# Altium schematic sheet 0154_BATTERY PATH.SchDoc
size 848 x 558 mm
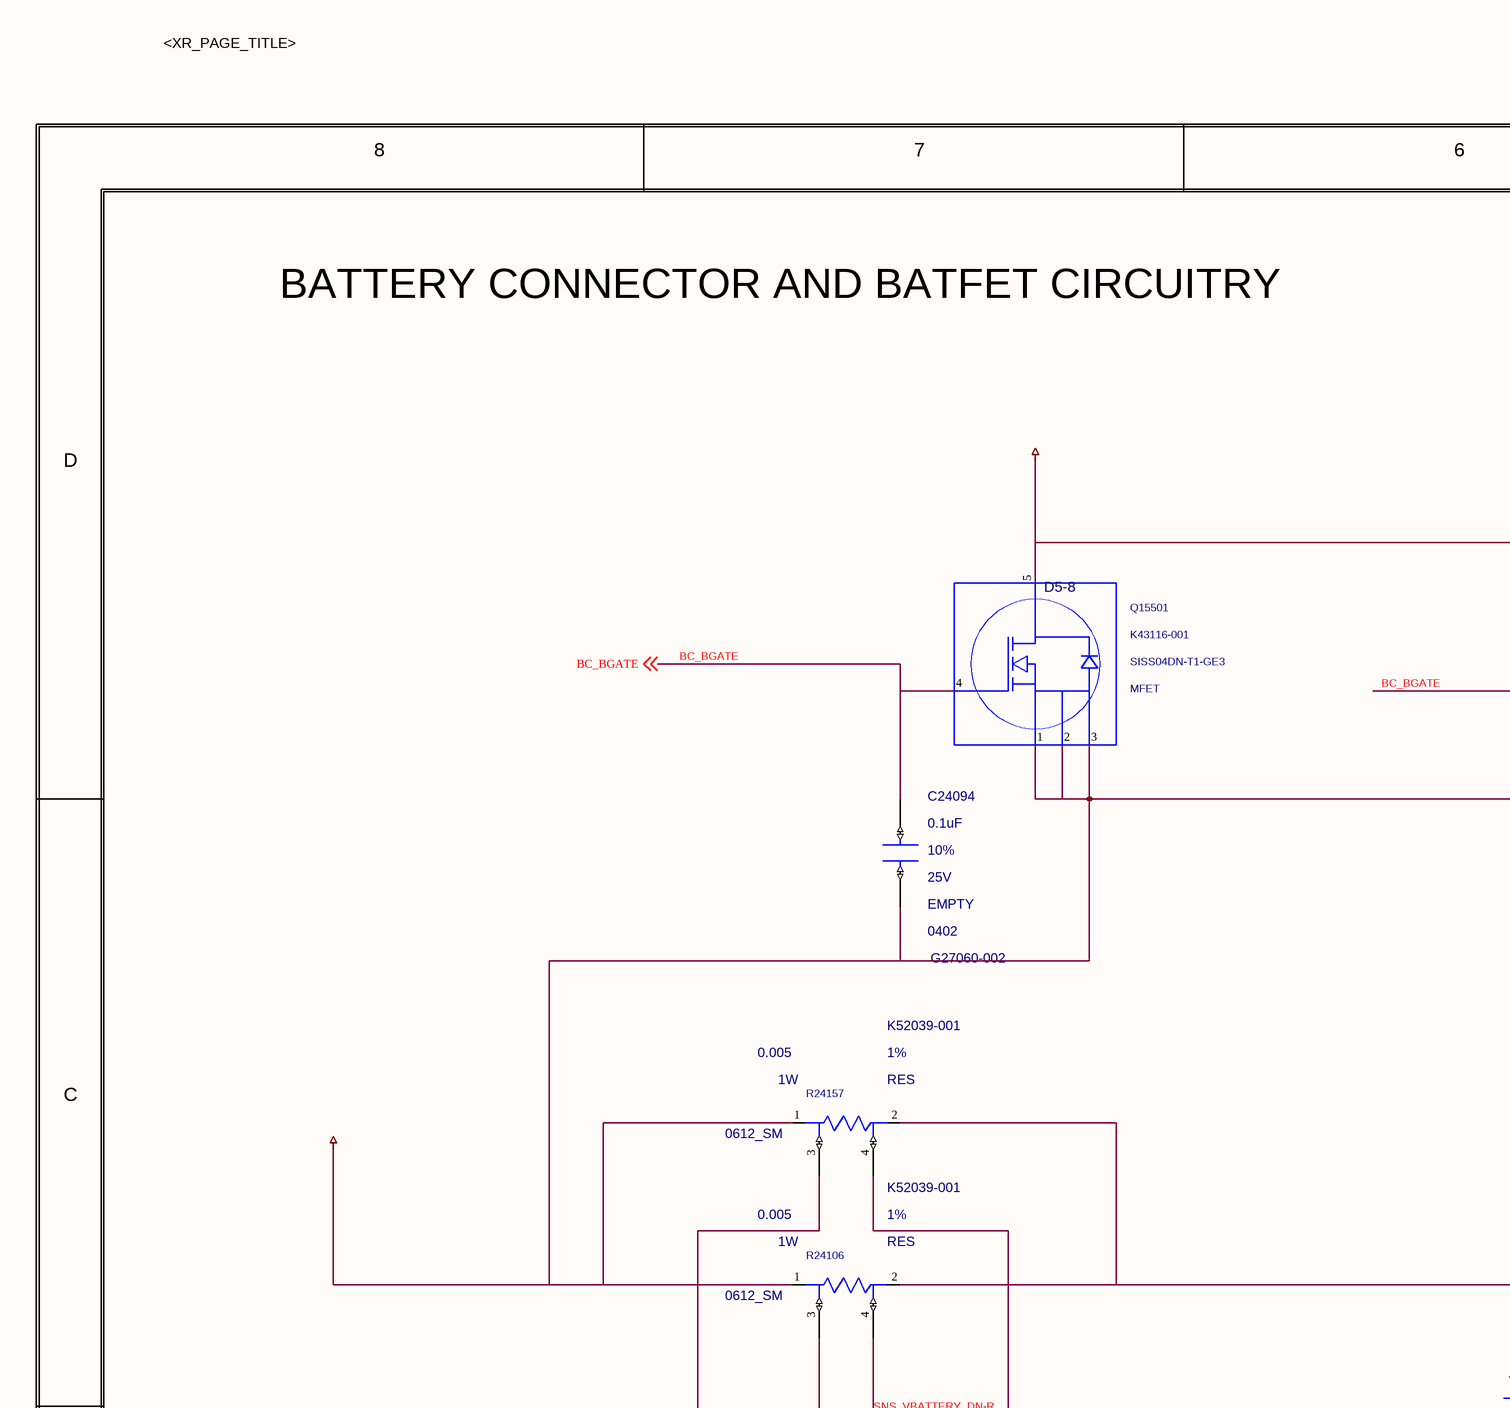
[diagram p0: 0154_BATTERY PATH.SchDoc, top left]
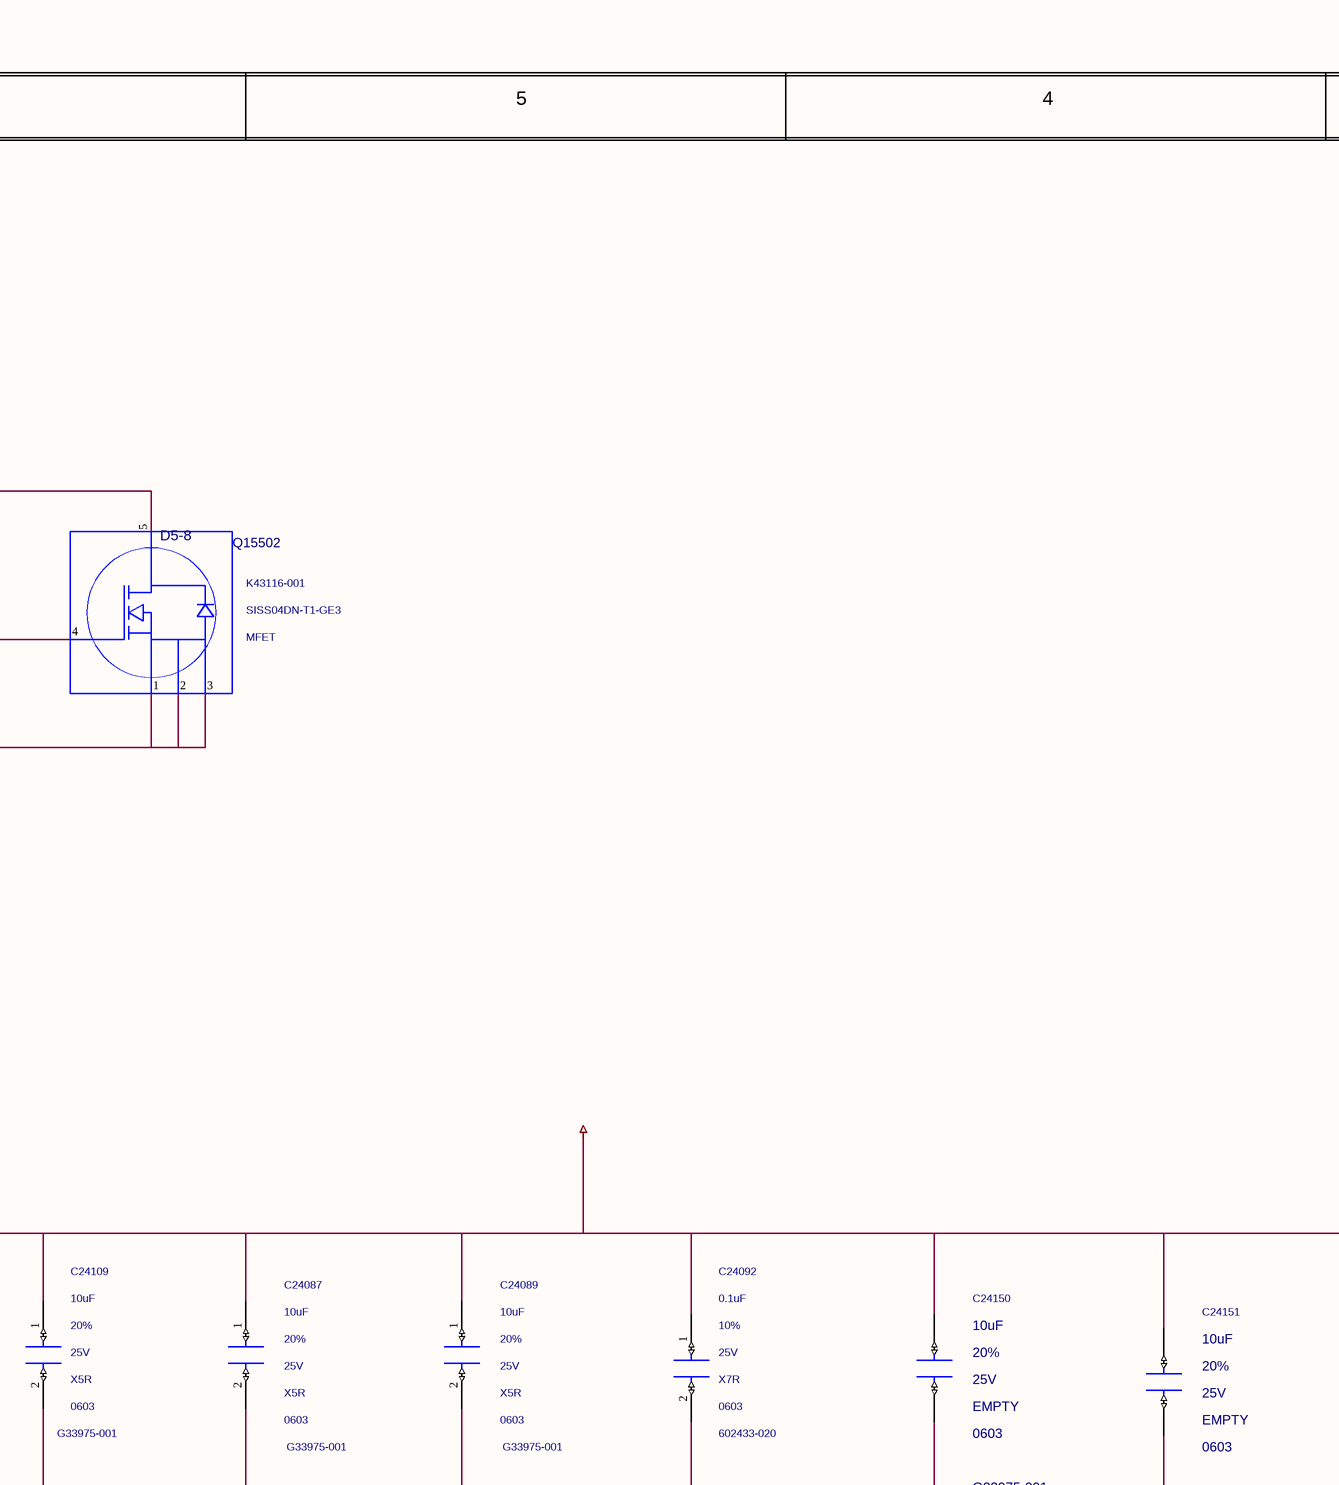
[diagram p1: 0154_BATTERY PATH.SchDoc, top middle]
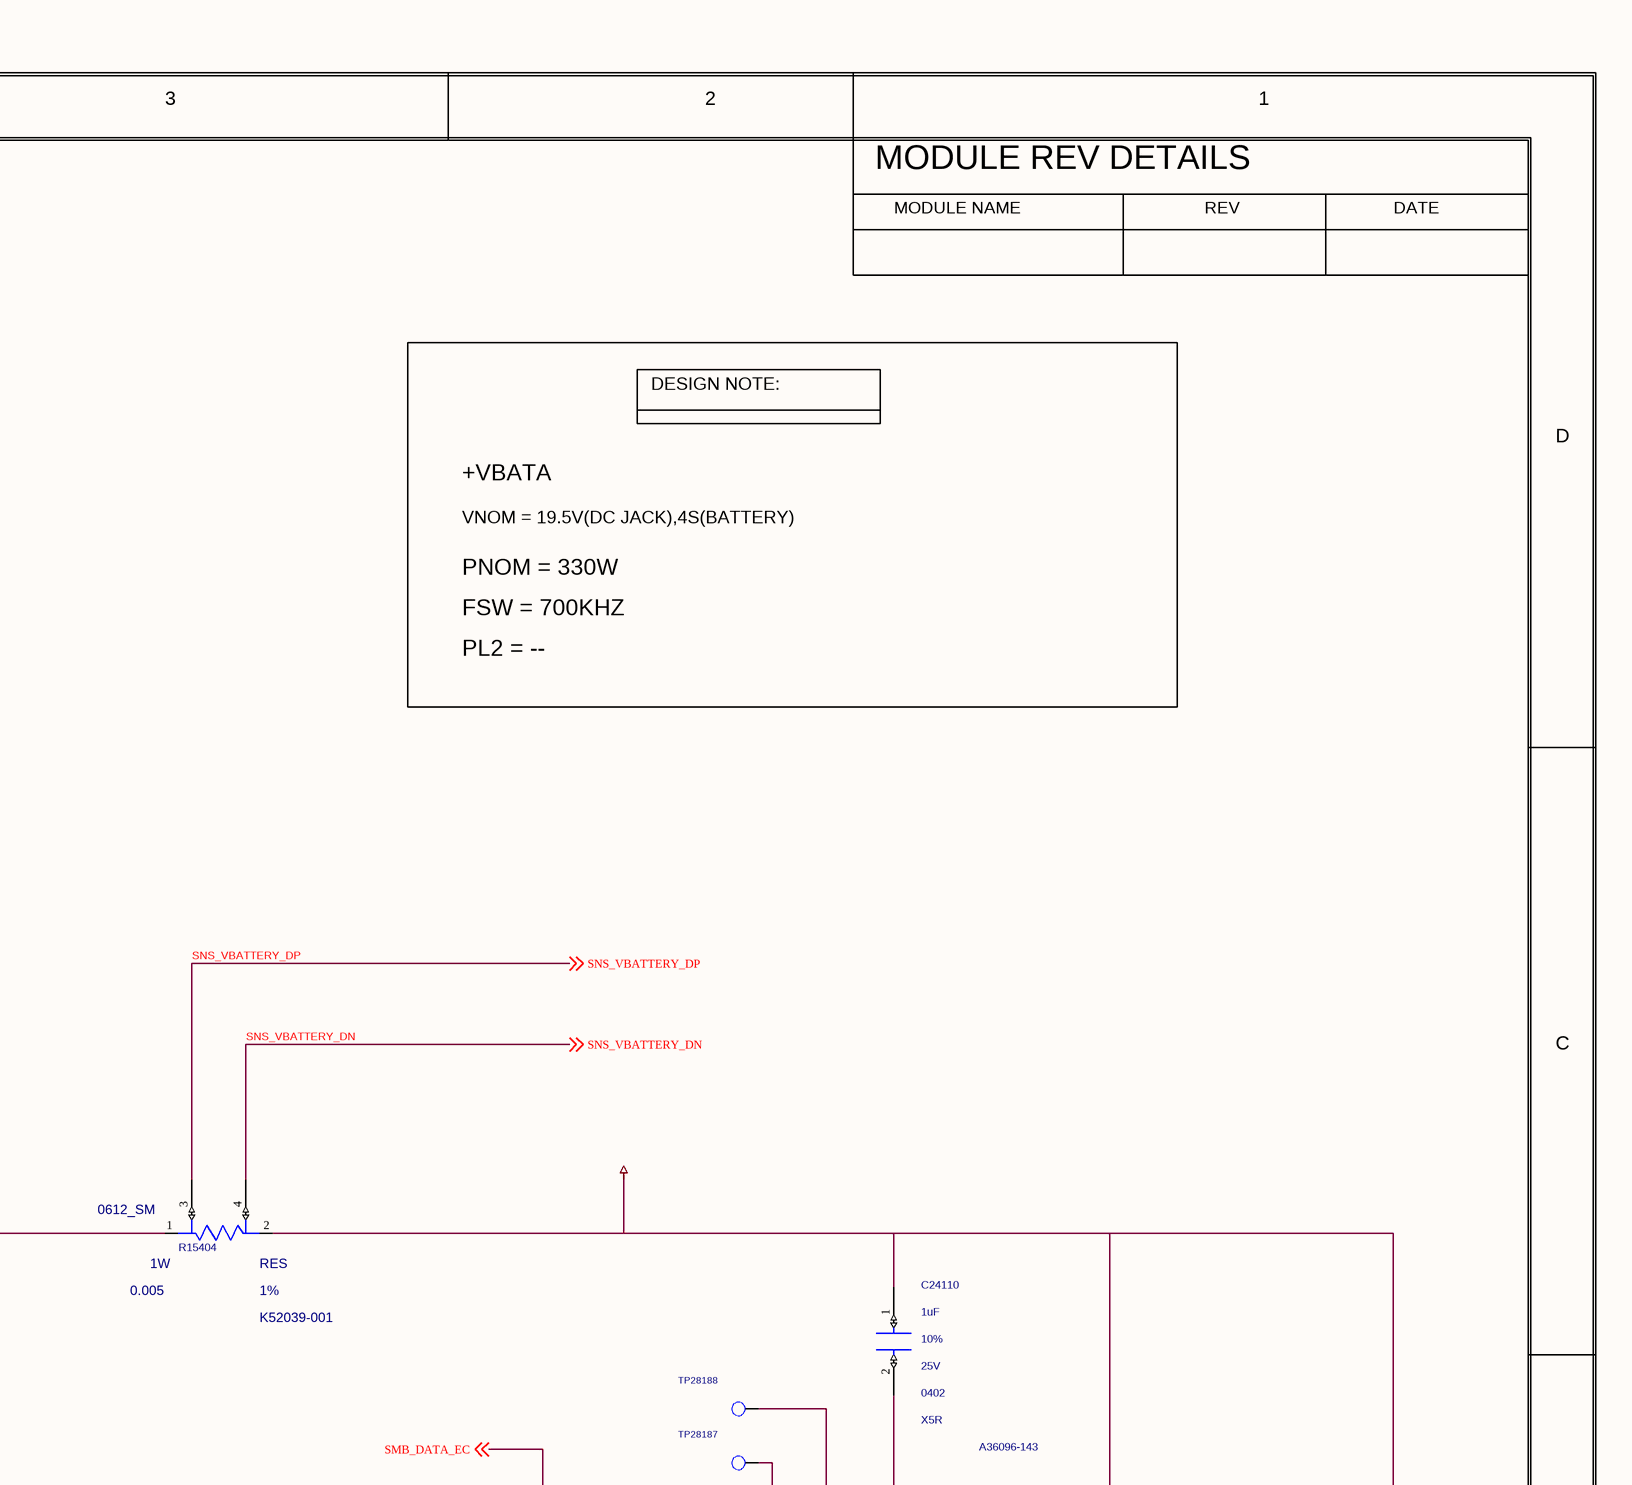
[diagram p2: 0154_BATTERY PATH.SchDoc, top right]
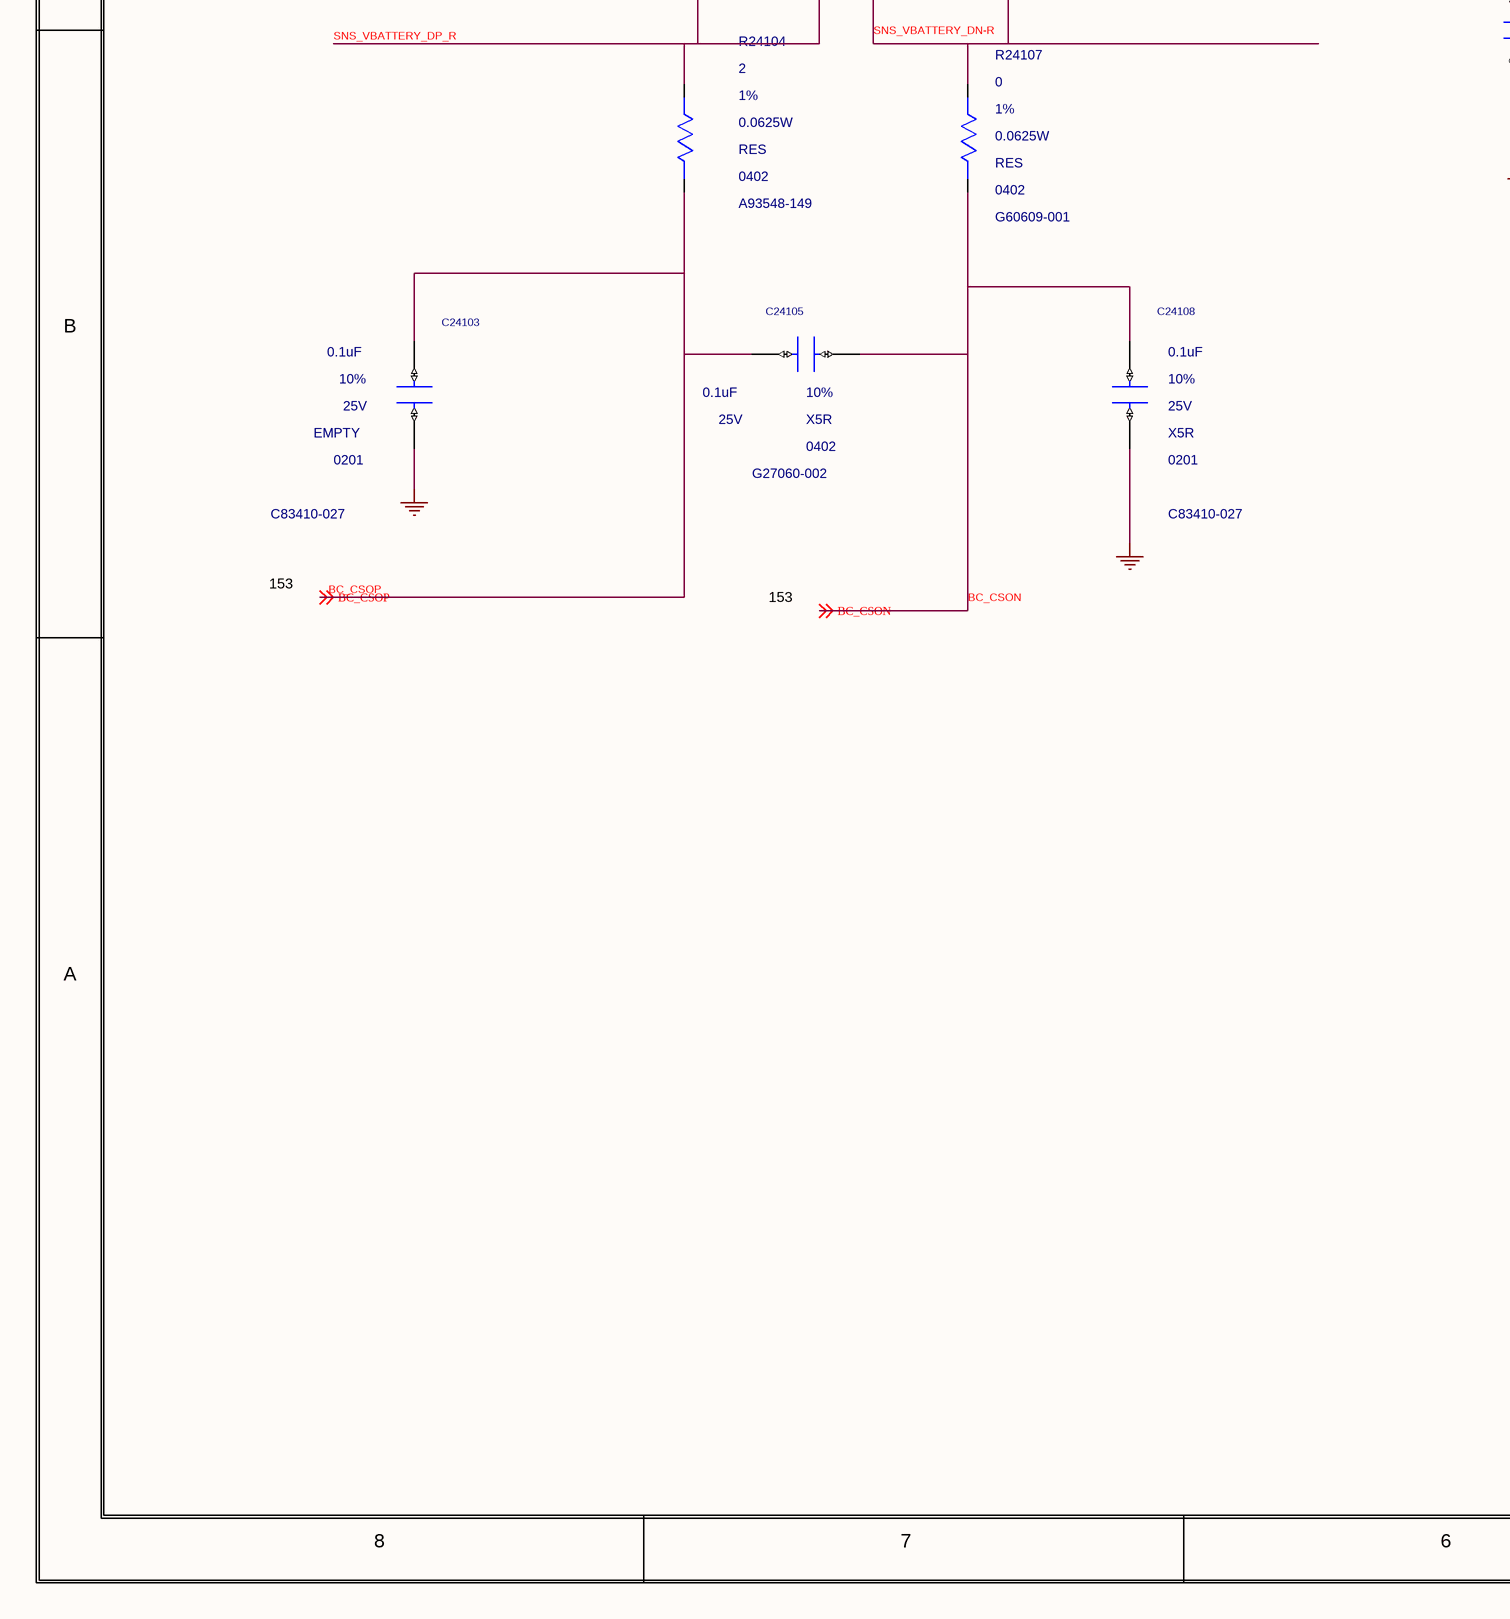
[diagram p3: 0154_BATTERY PATH.SchDoc, bottom left]
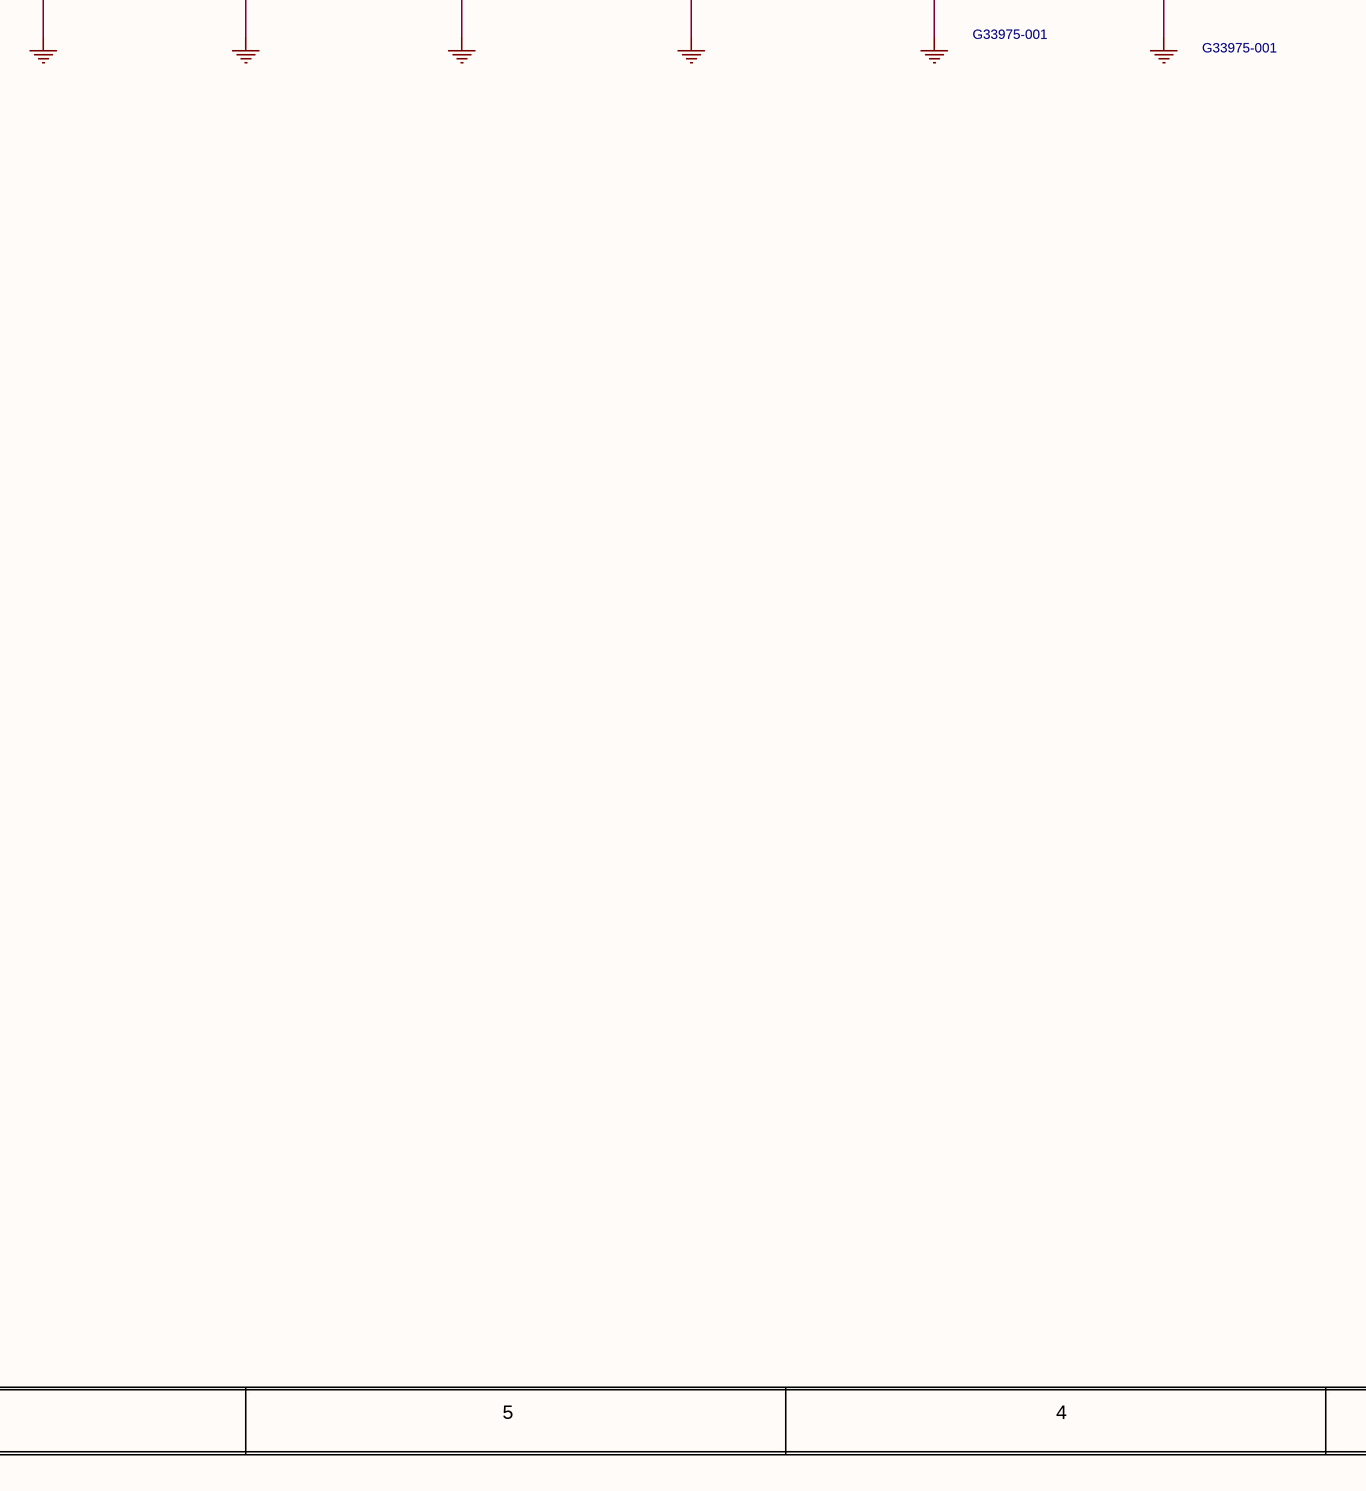
[diagram p4: 0154_BATTERY PATH.SchDoc, bottom middle]
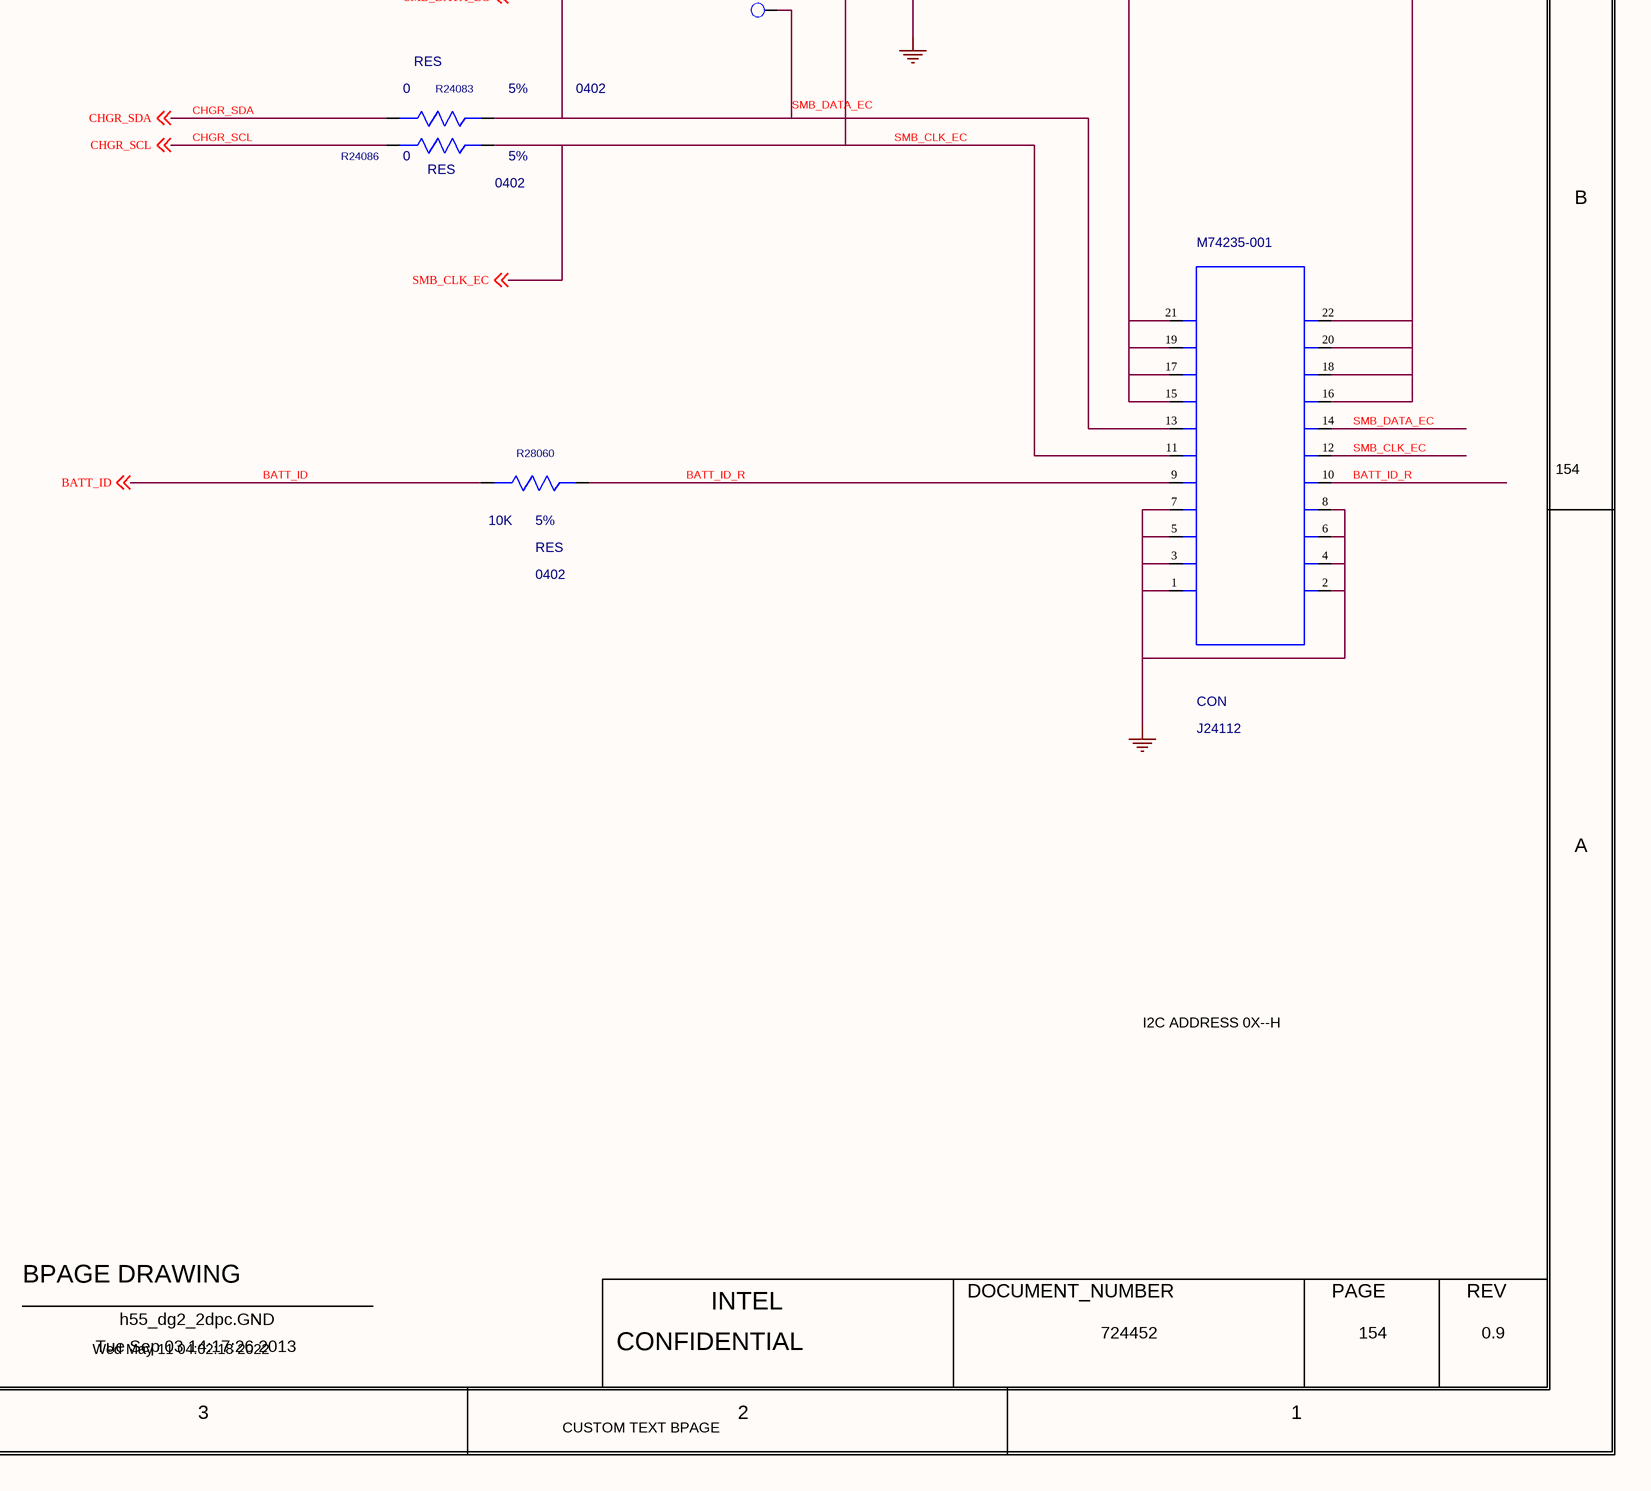
[diagram p5: 0154_BATTERY PATH.SchDoc, bottom right]

## Parts
C24087  10uF  MATERIAL: X5R  PACK_TYPE: 0603  PART_NUMBER: G33975-001  TOLERANCE: 20%  VOLTAGE: 25V  [SMC0603IA]
C24089  10uF  MATERIAL: X5R  PACK_TYPE: 0603  PART_NUMBER: G33975-001  TOLERANCE: 20%  VOLTAGE: 25V  [SMC0603IA]
C24092  0.1uF  MATERIAL: X7R  PACK_TYPE: 0603  PART_NUMBER: 602433-020  TOLERANCE: 10%  VOLTAGE: 25V  [SMC0603IA]
C24094  0.1uF  MATERIAL: EMPTY  PACK_TYPE: 0402  PART_NUMBER: G27060-002  TOLERANCE: 10%  VOLTAGE: 25V  [TK0_SM0402_1050X550_MB]
C24103  0.1uF  MATERIAL: EMPTY  PACK_TYPE: 0201  PART_NUMBER: C83410-027  TOLERANCE: 10%  VOLTAGE: 25V  [CTK2_SM0201_650X350_MA]
C24105  0.1uF  MATERIAL: X5R  PACK_TYPE: 0402  PART_NUMBER: G27060-002  TOLERANCE: 10%  VOLTAGE: 25V  [CTK2_SM0402_1050X550_MA]
C24108  0.1uF  MATERIAL: X5R  PACK_TYPE: 0201  PART_NUMBER: C83410-027  TOLERANCE: 10%  VOLTAGE: 25V  [CTK2_SM0201_650X350_MA]
C24109  10uF  MATERIAL: X5R  PACK_TYPE: 0603  PART_NUMBER: G33975-001  TOLERANCE: 20%  VOLTAGE: 25V  [SMC0603IA]
C24110  1uF  MATERIAL: X5R  PACK_TYPE: 0402  PART_NUMBER: A36096-143  TOLERANCE: 10%  VOLTAGE: 25V  [SMC0402MA]
C24150  10uF  MATERIAL: EMPTY  PACK_TYPE: 0603  PART_NUMBER: G33975-001  TOLERANCE: 20%  VOLTAGE: 25V  [CTK0_SM0603_1800X1000_MA]
C24151  10uF  MATERIAL: EMPTY  PACK_TYPE: 0603  PART_NUMBER: G33975-001  TOLERANCE: 20%  VOLTAGE: 25V  [CTK0_SM0603_1800X1000_MA]
J24112  MATERIAL: CON  PART_NUMBER: M74235-001  [CTK0_B2B_SPR_2X11_1500_MA_VR]  (hidden comment: C_B2B_2X11)
Q15501  SISS04DN-T1-GE3  MATERIAL: MFET  PART_NUMBER: K43116-001  [CTK0_LCC8_S3300_650_MA_VR]
Q15502  SISS04DN-T1-GE3  MATERIAL: MFET  PART_NUMBER: K43116-001  [CTK0_LCC8_S3300_650_MA_VR]
R15404  0.005  MATERIAL: RES  PACK_TYPE: 0612_SM  PART_NUMBER: K52039-001  TOLERANCE: 1%  WATTAGE: 1W  [CTK0_SMR4_0612_1800X3450_MB_VR]
R24083  0  MATERIAL: RES  PACK_TYPE: 0402  TOLERANCE: 5%  [CTK2_SM0402_1100X550_MA]
R24086  0  MATERIAL: RES  PACK_TYPE: 0402  TOLERANCE: 5%  [CTK2_SM0402_1100X550_MA]
R24104  2  MATERIAL: RES  PACK_TYPE: 0402  PART_NUMBER: A93548-149  TOLERANCE: 1%  WATTAGE: 0.0625W  [CTK2_SM0402_1100X550_MA]
R24106  0.005  MATERIAL: RES  PACK_TYPE: 0612_SM  PART_NUMBER: K52039-001  TOLERANCE: 1%  WATTAGE: 1W  [CTK0_SMR4_0612_1800X3450_MB_VR]
R24107  0  MATERIAL: RES  PACK_TYPE: 0402  PART_NUMBER: G60609-001  TOLERANCE: 1%  WATTAGE: 0.0625W  [CTK2_SM0402_1050X550_MA]
R24157  0.005  MATERIAL: RES  PACK_TYPE: 0612_SM  PART_NUMBER: K52039-001  TOLERANCE: 1%  WATTAGE: 1W  [CTK0_SMR4_0612_1800X3450_MB_VR]
R28060  10K  MATERIAL: RES  PACK_TYPE: 0402  TOLERANCE: 5%  [CTK2_SM0402_1100X550_MA]
TP28187  TP  [TP_C25]  (value not drawn)
TP28188  TP  [TP_C25]  (value not drawn)

## Nets
+VBATA: Q15501.5(D) Q15502.5(D)
+VBATTERY: C24110.1(A) J24112.15(IO15) J24112.16(IO16) J24112.17(IO17) J24112.18(IO18) J24112.19(IO19) J24112.20(IO20) J24112.21(IO21) J24112.22(IO22) R15404.2(PWRB)
+VBATTERY_IND: C24094.2(B) Q15501.1(S1) Q15501.2(S2) Q15501.3(S3) Q15502.1(S1) Q15502.2(S2) Q15502.3(S3) R24106.1(PWRA) R24157.1(PWRA)
+VBATTERY_R: C24087.1(A) C24089.1(A) C24092.1(A) C24109.1(A) C24150.1(A) C24151.1(A) R15404.1(PWRA) R24106.2(PWRB) R24157.2(PWRB)
GND: C24087.2(B) C24089.2(B) C24092.2(B) C24103.2(B) C24108.2(B) C24109.2(B) C24110.2(B) C24150.2(B) C24151.2(B) J24112.1(IO1) J24112.2(IO2) J24112.3(IO3) J24112.4(IO4) J24112.5(IO5) J24112.6(IO6) J24112.7(IO7) J24112.8(IO8)
BATT_ID: R28060.1(A) ; off-sheet BATT_ID
BATT_ID_R: J24112.9(IO9) J24112.10(IO10) R28060.2(B)
BC_BGATE: C24094.1(A) Q15501.4(G) Q15502.4(G) ; off-sheet BC_BGATE
BC_CSON: C24105.2(B) C24108.1(A) R24107.2(B) ; off-sheet BC_CSON
BC_CSOP: C24103.1(A) C24105.1(A) R24104.2(B) ; off-sheet BC_CSOP
CHGR_SCL: R24086.1(A) ; off-sheet CHGR_SCL
CHGR_SDA: R24083.1(A) ; off-sheet CHGR_SDA
SMB_CLK_EC: J24112.11(IO11) J24112.12(IO12) R24086.2(B) TP28188.1(TP) ; off-sheet SMB_CLK_EC
SMB_DATA_EC: J24112.13(IO13) J24112.14(IO14) R24083.2(B) TP28187.1(TP) ; off-sheet SMB_DATA_EC
SNS_VBATTERY_DN: R15404.4(SENB) ; off-sheet SNS_VBATTERY_DN
SNS_VBATTERY_DN-R: R24106.4(SENB) R24107.1(A) R24157.4(SENB)
SNS_VBATTERY_DP: R15404.3(SENA) ; off-sheet SNS_VBATTERY_DP
SNS_VBATTERY_DP_R: R24104.1(A) R24106.3(SENA) R24157.3(SENA)

## Notes on the sheet
- <XR_PAGE_TITLE>
- 8
- 7
- 6
- 5
- 4
- 3
- 2
- 1
- MODULE REV DETAILS
- BATTERY CONNECTOR AND BATFET CIRCUITRY
- MODULE NAME
- REV
- DATE
- DESIGN NOTE:
- D
- +VBATA
- VNOM = 19.5V(DC JACK),4S(BATTERY)
- PNOM = 330W
- PL2 = --
- FSW = 700KHZ
- C
- B
- 153
- 154
- A
- I2C ADDRESS 0X--H
- BPAGE DRAWING
- INTEL
- DOCUMENT_NUMBER
- PAGE
- Wed May 11 04:02:18 2022
- Tue Sep 03 14:17:26 2013
- h55_dg2_2dpc.GND
- CONFIDENTIAL
- 724452
- 0.9
- CUSTOM TEXT BPAGE
- (in symbol C_MOSFET_N_4D3S1G) D5-8

## Library data of the parts
C24087 = CAP: CDS_PHYS_PART_NAME: CAP_0603-G33975-001,X5R,10UF,25V,20%,LPDB,GENERIC; OriginalSymbolOrigin: (-50,25); XY: (-5000,2850); VER: 1; ROT: 0; PHYS_PAGE: 154; LOCATION: C24087; DRAWING: @RVP1_ADL_SB_ADP_S_DDR5_SODIMM_2DPC_LIB.H55_DG2_2DPC(SCH_1):PAGE523; CDS_LIB: discrete; PCB Footprint: SMC0603IA; SEC_TYPE: 0603; CHIPS_PART_NAME: CAP; CDS_PART_NAME: CAP_0603-G33975-001,X5R,10UF,25V,20%,LPDB,GENERIC; CDS_LOCATION: C24087
C24089 = CAP: CDS_PHYS_PART_NAME: CAP_0603-G33975-001,X5R,10UF,25V,20%,LPDB,GENERIC; OriginalSymbolOrigin: (-50,25); XY: (-4600,2850); VER: 1; ROT: 0; PHYS_PAGE: 154; LOCATION: C24089; DRAWING: @RVP1_ADL_SB_ADP_S_DDR5_SODIMM_2DPC_LIB.H55_DG2_2DPC(SCH_1):PAGE523; CDS_LIB: discrete; PCB Footprint: SMC0603IA; SEC_TYPE: 0603; CHIPS_PART_NAME: CAP; CDS_PART_NAME: CAP_0603-G33975-001,X5R,10UF,25V,20%,LPDB,GENERIC; CDS_LOCATION: C24089
C24092 = CAP: CDS_PHYS_PART_NAME: CAP_0603-602433-020,X7R,0.1UF,25V,10%,LPDB,GENERIC; OriginalSymbolOrigin: (-50,25); XY: (-4175,2825); VER: 1; ROT: 0; PHYS_PAGE: 154; LOCATION: C24092; DRAWING: @RVP1_ADL_SB_ADP_S_DDR5_SODIMM_2DPC_LIB.H55_DG2_2DPC(SCH_1):PAGE523; CDS_LIB: discrete; PCB Footprint: SMC0603IA; SEC_TYPE: 0603; CHIPS_PART_NAME: CAP; CDS_PART_NAME: CAP_0603-602433-020,X7R,0.1UF,25V,10%,LPDB,GENERIC; CDS_LOCATION: C24092
C24094 = CAP_2: CDS_PHYS_PART_NAME: CAP_2_0402-G27060-002,EMPTY,0.1UF,25V,10%,TK0,GENERIC; BOM_USE: STUFF; CDS_LMAN_SYM_OUTLINE: -50,50,50,-50; FP_TECH: TK0; IP: GENERIC; ROOM: NONE; OriginalSymbolOrigin: (-50,25); XY: (-6525,3875); VER: 1; ROT: 0; PHYS_PAGE: 154; LOCATION: C24094; DRAWING: @RVP1_ADL_SB_ADP_S_DDR5_SODIMM_2DPC_LIB.H55_DG2_2DPC(SCH_1):PAGE523; CDS_LIB: discrete_2; VARIANT: ?; PCB Footprint: TK0_SM0402_1050X550_MB; CHIPS_PART_NAME: CAP_2; CDS_PART_NAME: CAP_2_0402-G27060-002,EMPTY,0.1UF,25V,10%,TK0,GENERIC; CDS_LOCATION: C24094
C24103 = C_CAP: CDS_PHYS_PART_NAME: C_CAP_0201-C83410-027,EMPTY,0.1UF,25V,10%,TK2,GENERIC; CDS_LMAN_SYM_OUTLINE: -50,50,50,-50; FP_TECH: TK2; IP: GENERIC; ROOM: NONE; OriginalSymbolOrigin: (-50,25); XY: (-7425,2175); VER: 1; SUB_ROOM_2: PLACEHOLDER; SUB_ROOM_1: V_CHRG_LDO; SUB_ROOM: DECOUPLING; ROT: 2; PHYS_PAGE: 154; LOCATION: C24103; DRAWING: @RVP1_ADL_SB_ADP_S_DDR5_SODIMM_2DPC_LIB.H55_DG2_2DPC(SCH_1):PAGE523; CDS_LIB: c_discrete; VARIANT: ?; PCB Footprint: CTK2_SM0201_650X350_MA; CHIPS_PART_NAME: C_CAP; CDS_PART_NAME: C_CAP_0201-C83410-027,EMPTY,0.1UF,25V,10%,TK2,GENERIC; CDS_LOCATION: C24103
C24105 = C_CAP#1: CHIPS_PART_NAME: C_CAP; CDS_PHYS_PART_NAME: C_CAP_0402-G27060-002,X5R,0.1UF,25V,10%,TK2,GENERIC; CDS_LMAN_SYM_OUTLINE: -50,50,50,-50; FP_TECH: TK2; IP: GENERIC; ROOM: NONE; OriginalSymbolOrigin: (-25,50); XY: (-6700,2250); VER: 2; SUB_ROOM_2: PLACEHOLDER; SUB_ROOM_1: V_CHRG_LDO; SUB_ROOM: COMPENSATION; ROT: 0; PHYS_PAGE: 154; LOCATION: C24105; DRAWING: @RVP1_ADL_SB_ADP_S_DDR5_SODIMM_2DPC_LIB.H55_DG2_2DPC(SCH_1):PAGE523; CDS_LIB: c_discrete; VARIANT: ?; PCB Footprint: CTK2_SM0402_1050X550_MA; CDS_PART_NAME: C_CAP_0402-G27060-002,X5R,0.1UF,25V,10%,TK2,GENERIC; CDS_LOCATION: C24105
C24108 = C_CAP: CDS_PHYS_PART_NAME: C_CAP_0201-C83410-027,X5R,0.1UF,25V,10%,TK2,GENERIC; CDS_LMAN_SYM_OUTLINE: -50,50,50,-50; FP_TECH: TK2; IP: GENERIC; ROOM: NONE; OriginalSymbolOrigin: (-50,25); XY: (-6100,2175); VER: 1; SUB_ROOM_2: PLACEHOLDER; SUB_ROOM_1: V_CHRG_LDO; SUB_ROOM: DECOUPLING; ROT: 0; PHYS_PAGE: 154; LOCATION: C24108; DRAWING: @RVP1_ADL_SB_ADP_S_DDR5_SODIMM_2DPC_LIB.H55_DG2_2DPC(SCH_1):PAGE523; CDS_LIB: c_discrete; VARIANT: ?; PCB Footprint: CTK2_SM0201_650X350_MA; CHIPS_PART_NAME: C_CAP; CDS_PART_NAME: C_CAP_0201-C83410-027,X5R,0.1UF,25V,10%,TK2,GENERIC; CDS_LOCATION: C24108
C24109 = CAP: CDS_PHYS_PART_NAME: CAP_0603-G33975-001,X5R,10UF,25V,20%,LPDB,GENERIC; OriginalSymbolOrigin: (-50,25); XY: (-5375,2850); VER: 1; SUB_ROOM_2: DECOUPLING; SUB_ROOM_1: V_CHRG_LDO; ROT: 0; PHYS_PAGE: 154; LOCATION: C24109; DRAWING: @RVP1_ADL_SB_ADP_S_DDR5_SODIMM_2DPC_LIB.H55_DG2_2DPC(SCH_1):PAGE523; CDS_LIB: discrete; PCB Footprint: SMC0603IA; SUB_ROOM: DECOUPLING; SEC_TYPE: 0603; CHIPS_PART_NAME: CAP; CDS_PART_NAME: CAP_0603-G33975-001,X5R,10UF,25V,20%,LPDB,GENERIC; CDS_LOCATION: C24109
C24110 = CAP: CDS_PHYS_PART_NAME: CAP_0402-A36096-143,X5R,1UF,25V,10%,LPDB,GENERIC; OriginalSymbolOrigin: (-50,25); XY: (-1175,2875); VER: 1; SUB_ROOM_2: DECOUPLING; SUB_ROOM_1: V_CHRG_LDO; ROT: 2; PHYS_PAGE: 154; LOCATION: C24110; DRAWING: @RVP1_ADL_SB_ADP_S_DDR5_SODIMM_2DPC_LIB.H55_DG2_2DPC(SCH_1):PAGE523; CDS_LIB: discrete; PCB Footprint: SMC0402MA; SUB_ROOM: DECOUPLING; SEC_TYPE: 0402; CHIPS_PART_NAME: CAP; CDS_PART_NAME: CAP_0402-A36096-143,X5R,1UF,25V,10%,LPDB,GENERIC; CDS_LOCATION: C24110
C24150 = C_CAP: CDS_PHYS_PART_NAME: C_CAP_0603-G33975-001,EMPTY,10UF,25V,20%,TK0,GENERIC; CDS_LMAN_SYM_OUTLINE: -50,50,50,-50; FP_TECH: TK0; IP: GENERIC; ROOM: NONE; OriginalSymbolOrigin: (-50,25); XY: (-3725,2825); VER: 1; ROT: 0; PHYS_PAGE: 154; LOCATION: C24150; DRAWING: @RVP1_ADL_SB_ADP_S_DDR5_SODIMM_2DPC_LIB.H55_DG2_2DPC(SCH_1):PAGE523; CDS_LIB: c_discrete; VARIANT: ?; PCB Footprint: CTK0_SM0603_1800X1000_MA; CHIPS_PART_NAME: C_CAP; CDS_PART_NAME: C_CAP_0603-G33975-001,EMPTY,10UF,25V,20%,TK0,GENERIC; CDS_LOCATION: C24150
C24151 = C_CAP: CDS_PHYS_PART_NAME: C_CAP_0603-G33975-001,EMPTY,10UF,25V,20%,TK0,GENERIC; CDS_LMAN_SYM_OUTLINE: -50,50,50,-50; FP_TECH: TK0; IP: GENERIC; ROOM: NONE; OriginalSymbolOrigin: (-50,25); XY: (-3300,2800); VER: 1; ROT: 0; PHYS_PAGE: 154; LOCATION: C24151; DRAWING: @RVP1_ADL_SB_ADP_S_DDR5_SODIMM_2DPC_LIB.H55_DG2_2DPC(SCH_1):PAGE523; CDS_LIB: c_discrete; VARIANT: ?; PCB Footprint: CTK0_SM0603_1800X1000_MA; CHIPS_PART_NAME: C_CAP; CDS_PART_NAME: C_CAP_0603-G33975-001,EMPTY,10UF,25V,20%,TK0,GENERIC; CDS_LOCATION: C24151
J24112 = C_B2B_2X11: CDS_PHYS_PART_NAME: C_B2B_2X11_SM-M74235-001,CON,B2B_2X11,TK0,GENERIC; CDS_LMAN_SYM_OUTLINE: -100,350,100,-350; FP_TECH: TK0; IP: GENERIC; PACK_TYPE: SM; ROOM: NONE; OriginalSymbolOrigin: (-125,350); XY: (-550,1825); VER: 1; ROT: 6; PHYS_PAGE: 154; LOCATION: J24112; DRAWING: @RVP1_ADL_SB_ADP_S_DDR5_SODIMM_2DPC_LIB.H55_DG2_2DPC(SCH_1):PAGE523; CDS_LIB: local; VARIANT: ?; PCB Footprint: CTK0_B2B_SPR_2X11_1500_MA_VR; CHIPS_PART_NAME: C_B2B_2X11; CDS_PART_NAME: C_B2B_2X11_SM-M74235-001,CON,B2B_2X11,TK0,GENERIC; CDS_LOCATION: J24112
Q15501 = C_MOSFET_N_4D3S1G: CDS_PHYS_PART_NAME: C_MOSFET_N_4D3S1G_LCCA-K43116-001,MFET,SISS04DN-T1-GE3,TK0,GENEA; CDS_LMAN_SYM_OUTLINE: -150,150,150,-150; FP_TECH: TK0; IP: GENERIC; PACK_TYPE: LCCA; ROOM: NONE; OriginalSymbolOrigin: (-150,150); XY: (-6275,4225); VER: 2; ROT: 0; PHYS_PAGE: 154; LOCATION: Q15501; DRAWING: @RVP1_ADL_SB_ADP_S_DDR5_SODIMM_2DPC_LIB.H55_DG2_2DPC(SCH_1):PAGE523; CDS_LIB: local; VARIANT: ?; PCB Footprint: CTK0_LCC8_S3300_650_MA_VR; SEC_TYPE: LCCA; CHIPS_PART_NAME: C_MOSFET_N_4D3S1G; CDS_PART_NAME: C_MOSFET_N_4D3S1G_LCCA-K43116-001,MFET,SISS04DN-T1-GE3,TK0,GENEA; CDS_LOCATION: Q15501
Q15502 = C_MOSFET_N_4D3S1G: CDS_PHYS_PART_NAME: C_MOSFET_N_4D3S1G_LCCA-K43116-001,MFET,SISS04DN-T1-GE3,TK0,GENEA; CDS_LMAN_SYM_OUTLINE: -150,150,150,-150; FP_TECH: TK0; IP: GENERIC; PACK_TYPE: LCCA; ROOM: NONE; OriginalSymbolOrigin: (-150,150); XY: (-5175,4225); VER: 2; ROT: 0; PHYS_PAGE: 154; LOCATION: Q15502; DRAWING: @RVP1_ADL_SB_ADP_S_DDR5_SODIMM_2DPC_LIB.H55_DG2_2DPC(SCH_1):PAGE523; CDS_LIB: local; VARIANT: ?; PCB Footprint: CTK0_LCC8_S3300_650_MA_VR; SEC_TYPE: LCCA; CHIPS_PART_NAME: C_MOSFET_N_4D3S1G; CDS_PART_NAME: C_MOSFET_N_4D3S1G_LCCA-K43116-001,MFET,SISS04DN-T1-GE3,TK0,GENEA; CDS_LOCATION: Q15502
R15404 = C_RES_4TERM: CDS_PHYS_PART_NAME: C_RES_4TERM_0612_SM-K52039-001,RES,0.005,1%,1W,TK0,GENERIC; CDS_LMAN_SYM_OUTLINE: -50,50,50,-50; FP_TECH: TK0; IP: GENERIC; ROOM: NONE; OriginalSymbolOrigin: (-75,25); XY: (-2425,3075); VER: 1; SUB_ROOM_2: PMR; SUB_ROOM_1: V_CHRG_LDO; ROT: 6; PHYS_PAGE: 154; LOCATION: R15404; DRAWING: @RVP1_ADL_SB_ADP_S_DDR5_SODIMM_2DPC_LIB.H55_DG2_2DPC(SCH_1):PAGE523; CDS_LIB: c_discrete; VARIANT: ?; PCB Footprint: CTK0_SMR4_0612_1800X3450_MB_VR; SUB_ROOM: PMR; CHIPS_PART_NAME: C_RES_4TERM; CDS_PART_NAME: C_RES_4TERM_0612_SM-K52039-001,RES,0.005,1%,1W,TK0,GENERIC; CDS_LOCATION: R15404
R24083 = C_RES#1: PART_NUMBER: A93549-001; CHIPS_PART_NAME: C_RES; CDS_PHYS_PART_NAME: C_RES_0402-A93549-001,RES,0,5%,0.0625W,TK2,GENERIC; CDS_LMAN_SYM_OUTLINE: -50,50,50,-50; FP_TECH: TK2; IP: GENERIC; ROOM: NONE; WATTAGE: 0.0625W; OriginalSymbolOrigin: (-75,25); XY: (-2050,2450); VER: 1; PHYS_PAGE: 154; LOCATION: R24083; DRAWING: @RVP1_ADL_SB_ADP_S_DDR5_SODIMM_2DPC_LIB.H55_DG2_2DPC(SCH_1):PAGE523; CDS_LIB: c_discrete; VARIANT: ?; PCB Footprint: CTK2_SM0402_1100X550_MA; ROT: 0; CDS_PART_NAME: C_RES_0402-A93549-001,RES,0,5%,0.0625W,TK2,GENERIC; CDS_LOCATION: R24083
R24086 = C_RES#1: PART_NUMBER: A93549-001; CHIPS_PART_NAME: C_RES; CDS_PHYS_PART_NAME: C_RES_0402-A93549-001,RES,0,5%,0.0625W,TK2,GENERIC; CDS_LMAN_SYM_OUTLINE: -50,50,50,-50; FP_TECH: TK2; IP: GENERIC; ROOM: NONE; WATTAGE: 0.0625W; OriginalSymbolOrigin: (-75,25); XY: (-2050,2400); VER: 1; PHYS_PAGE: 154; LOCATION: R24086; DRAWING: @RVP1_ADL_SB_ADP_S_DDR5_SODIMM_2DPC_LIB.H55_DG2_2DPC(SCH_1):PAGE523; CDS_LIB: c_discrete; VARIANT: ?; PCB Footprint: CTK2_SM0402_1100X550_MA; ROT: 0; CDS_PART_NAME: C_RES_0402-A93549-001,RES,0,5%,0.0625W,TK2,GENERIC; CDS_LOCATION: R24086
R24104 = C_RES: CDS_PHYS_PART_NAME: C_RES_0402-A93548-149,RES,2,1%,0.0625W,TK2,GENERIC; CDS_LMAN_SYM_OUTLINE: -50,50,50,-50; FP_TECH: TK2; IP: GENERIC; ROOM: NONE; OriginalSymbolOrigin: (-25,75); XY: (-6925,2650); ROT: 0; PHYS_PAGE: 154; LOCATION: R24104; DRAWING: @RVP1_ADL_SB_ADP_S_DDR5_SODIMM_2DPC_LIB.H55_DG2_2DPC(SCH_1):PAGE523; CDS_LIB: c_discrete; VARIANT: ?; PCB Footprint: CTK2_SM0402_1100X550_MA; VER: 2; CHIPS_PART_NAME: C_RES; CDS_PART_NAME: C_RES_0402-A93548-149,RES,2,1%,0.0625W,TK2,GENERIC; CDS_LOCATION: R24104
R24106 = C_RES_4TERM: CDS_PHYS_PART_NAME: C_RES_4TERM_0612_SM-K52039-001,RES,0.005,1%,1W,TK0,GENERIC; CDS_LMAN_SYM_OUTLINE: -50,50,50,-50; FP_TECH: TK0; IP: GENERIC; ROOM: NONE; OriginalSymbolOrigin: (-75,25); XY: (-6625,3075); VER: 1; SUB_ROOM_2: PMR; SUB_ROOM_1: V_CHRG_LDO; ROT: 0; PHYS_PAGE: 154; LOCATION: R24106; DRAWING: @RVP1_ADL_SB_ADP_S_DDR5_SODIMM_2DPC_LIB.H55_DG2_2DPC(SCH_1):PAGE523; CDS_LIB: c_discrete; VARIANT: ?; PCB Footprint: CTK0_SMR4_0612_1800X3450_MB_VR; SUB_ROOM: PMR; CHIPS_PART_NAME: C_RES_4TERM; CDS_PART_NAME: C_RES_4TERM_0612_SM-K52039-001,RES,0.005,1%,1W,TK0,GENERIC; CDS_LOCATION: R24106
R24107 = C_RES: CDS_PHYS_PART_NAME: C_RES_0402-G60609-001,RES,0,1%,0.0625W,TK2,GENERIC; CDS_LMAN_SYM_OUTLINE: -50,50,50,-50; FP_TECH: TK2; IP: GENERIC; ROOM: NONE; OriginalSymbolOrigin: (-25,75); XY: (-6400,2650); VER: 2; PHYS_PAGE: 154; LOCATION: R24107; DRAWING: @RVP1_ADL_SB_ADP_S_DDR5_SODIMM_2DPC_LIB.H55_DG2_2DPC(SCH_1):PAGE523; CDS_LIB: c_discrete; VARIANT: ?; PCB Footprint: CTK2_SM0402_1050X550_MA; ROT: 0; CHIPS_PART_NAME: C_RES; CDS_PART_NAME: C_RES_0402-G60609-001,RES,0,1%,0.0625W,TK2,GENERIC; CDS_LOCATION: R24107
R24157 = C_RES_4TERM: CDS_PHYS_PART_NAME: C_RES_4TERM_0612_SM-K52039-001,RES,0.005,1%,1W,TK0,GENERIC; CDS_LMAN_SYM_OUTLINE: -50,50,50,-50; FP_TECH: TK0; IP: GENERIC; ROOM: NONE; OriginalSymbolOrigin: (-75,25); XY: (-6625,3375); VER: 1; SUB_ROOM_2: PMR; SUB_ROOM_1: V_CHRG_LDO; ROT: 0; PHYS_PAGE: 154; LOCATION: R24157; DRAWING: @RVP1_ADL_SB_ADP_S_DDR5_SODIMM_2DPC_LIB.H55_DG2_2DPC(SCH_1):PAGE523; CDS_LIB: c_discrete; VARIANT: ?; PCB Footprint: CTK0_SMR4_0612_1800X3450_MB_VR; SUB_ROOM: PMR; CHIPS_PART_NAME: C_RES_4TERM; CDS_PART_NAME: C_RES_4TERM_0612_SM-K52039-001,RES,0.005,1%,1W,TK0,GENERIC; CDS_LOCATION: R24157
R28060 = C_RES#1: PART_NUMBER: A93549-023; CHIPS_PART_NAME: C_RES; CDS_PHYS_PART_NAME: C_RES_0402-A93549-023,RES,10K,5%,0.0625W,TK2,GENERIC; CDS_LMAN_SYM_OUTLINE: -50,50,50,-50; FP_TECH: TK2; IP: GENERIC; ROOM: NONE; WATTAGE: 0.0625W; OriginalSymbolOrigin: (-75,25); XY: (-1875,1775); VER: 1; ROT: 0; PHYS_PAGE: 154; LOCATION: R28060; DRAWING: @RVP1_ADL_SB_ADP_S_DDR5_SODIMM_2DPC_LIB.H55_DG2_2DPC(SCH_1):PAGE523; CDS_LIB: c_discrete; VARIANT: ?; PCB Footprint: CTK2_SM0402_1100X550_MA; CDS_PART_NAME: C_RES_0402-A93549-023,RES,10K,5%,0.0625W,TK2,GENERIC; CDS_LOCATION: R28060
TP28187 = TP#3: PART_NUMBER: NA_TPC25; CDS_PHYS_PART_NAME: TP_SM-NA_TPC25,EMPTY,TP_C25,LPDB,GENERIC; CDS_LMAN_SYM_OUTLINE: -100,50,100,-50; PACK_TYPE: SM; OriginalSymbolOrigin: (0,25); XY: (-1475,2650); VER: 6; ROT: 0; ROOM: ROOM_PROP_TEST_70; PHYS_PAGE: 154; LOCATION: TP28187; DRAWING: @RVP1_ADL_SB_ADP_S_DDR5_SODIMM_2DPC_LIB.H55_DG2_2DPC(SCH_1):PAGE523; CDS_LIB: board_artifacts; MATERIAL: EMPTY; PCB Footprint: TP_C25; CHIPS_PART_NAME: TP; CDS_PART_NAME: TP_SM-NA_TPC25,EMPTY,TP_C25,LPDB,GENERIC; CDS_LOCATION: TP28187
TP28188 = TP#3: PART_NUMBER: NA_TPC25; CDS_PHYS_PART_NAME: TP_SM-NA_TPC25,EMPTY,TP_C25,LPDB,GENERIC; CDS_LMAN_SYM_OUTLINE: -100,50,100,-50; PACK_TYPE: SM; OriginalSymbolOrigin: (0,25); XY: (-1475,2750); VER: 6; ROT: 0; ROOM: ROOM_PROP_TEST_70; PHYS_PAGE: 154; LOCATION: TP28188; DRAWING: @RVP1_ADL_SB_ADP_S_DDR5_SODIMM_2DPC_LIB.H55_DG2_2DPC(SCH_1):PAGE523; CDS_LIB: board_artifacts; MATERIAL: EMPTY; PCB Footprint: TP_C25; CHIPS_PART_NAME: TP; CDS_PART_NAME: TP_SM-NA_TPC25,EMPTY,TP_C25,LPDB,GENERIC; CDS_LOCATION: TP28188